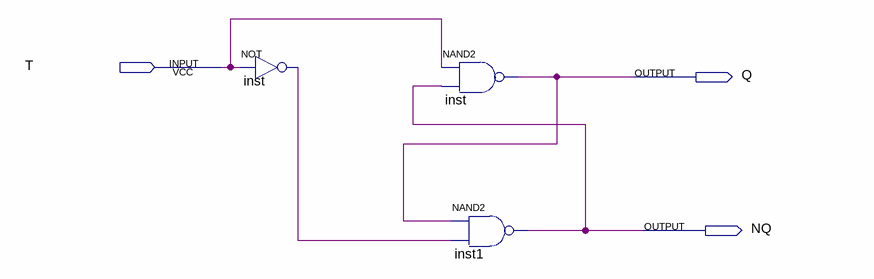
[diagram p0: schematic sheet]
// Quartus schematic latchTNAND.bdf as structural Verilog: 3 symbols, 3 pins
module latchTNAND (
  input  T,
  output Q,
  output NQ
);

  wire inst_out;

  not inst (inst_out, T);
  nand inst_dup2 (Q, T, NQ);
  nand inst1 (NQ, Q, inst_out);
endmodule
